# EAGLE schematic BoundaryController (EAGLE 6.6.0)
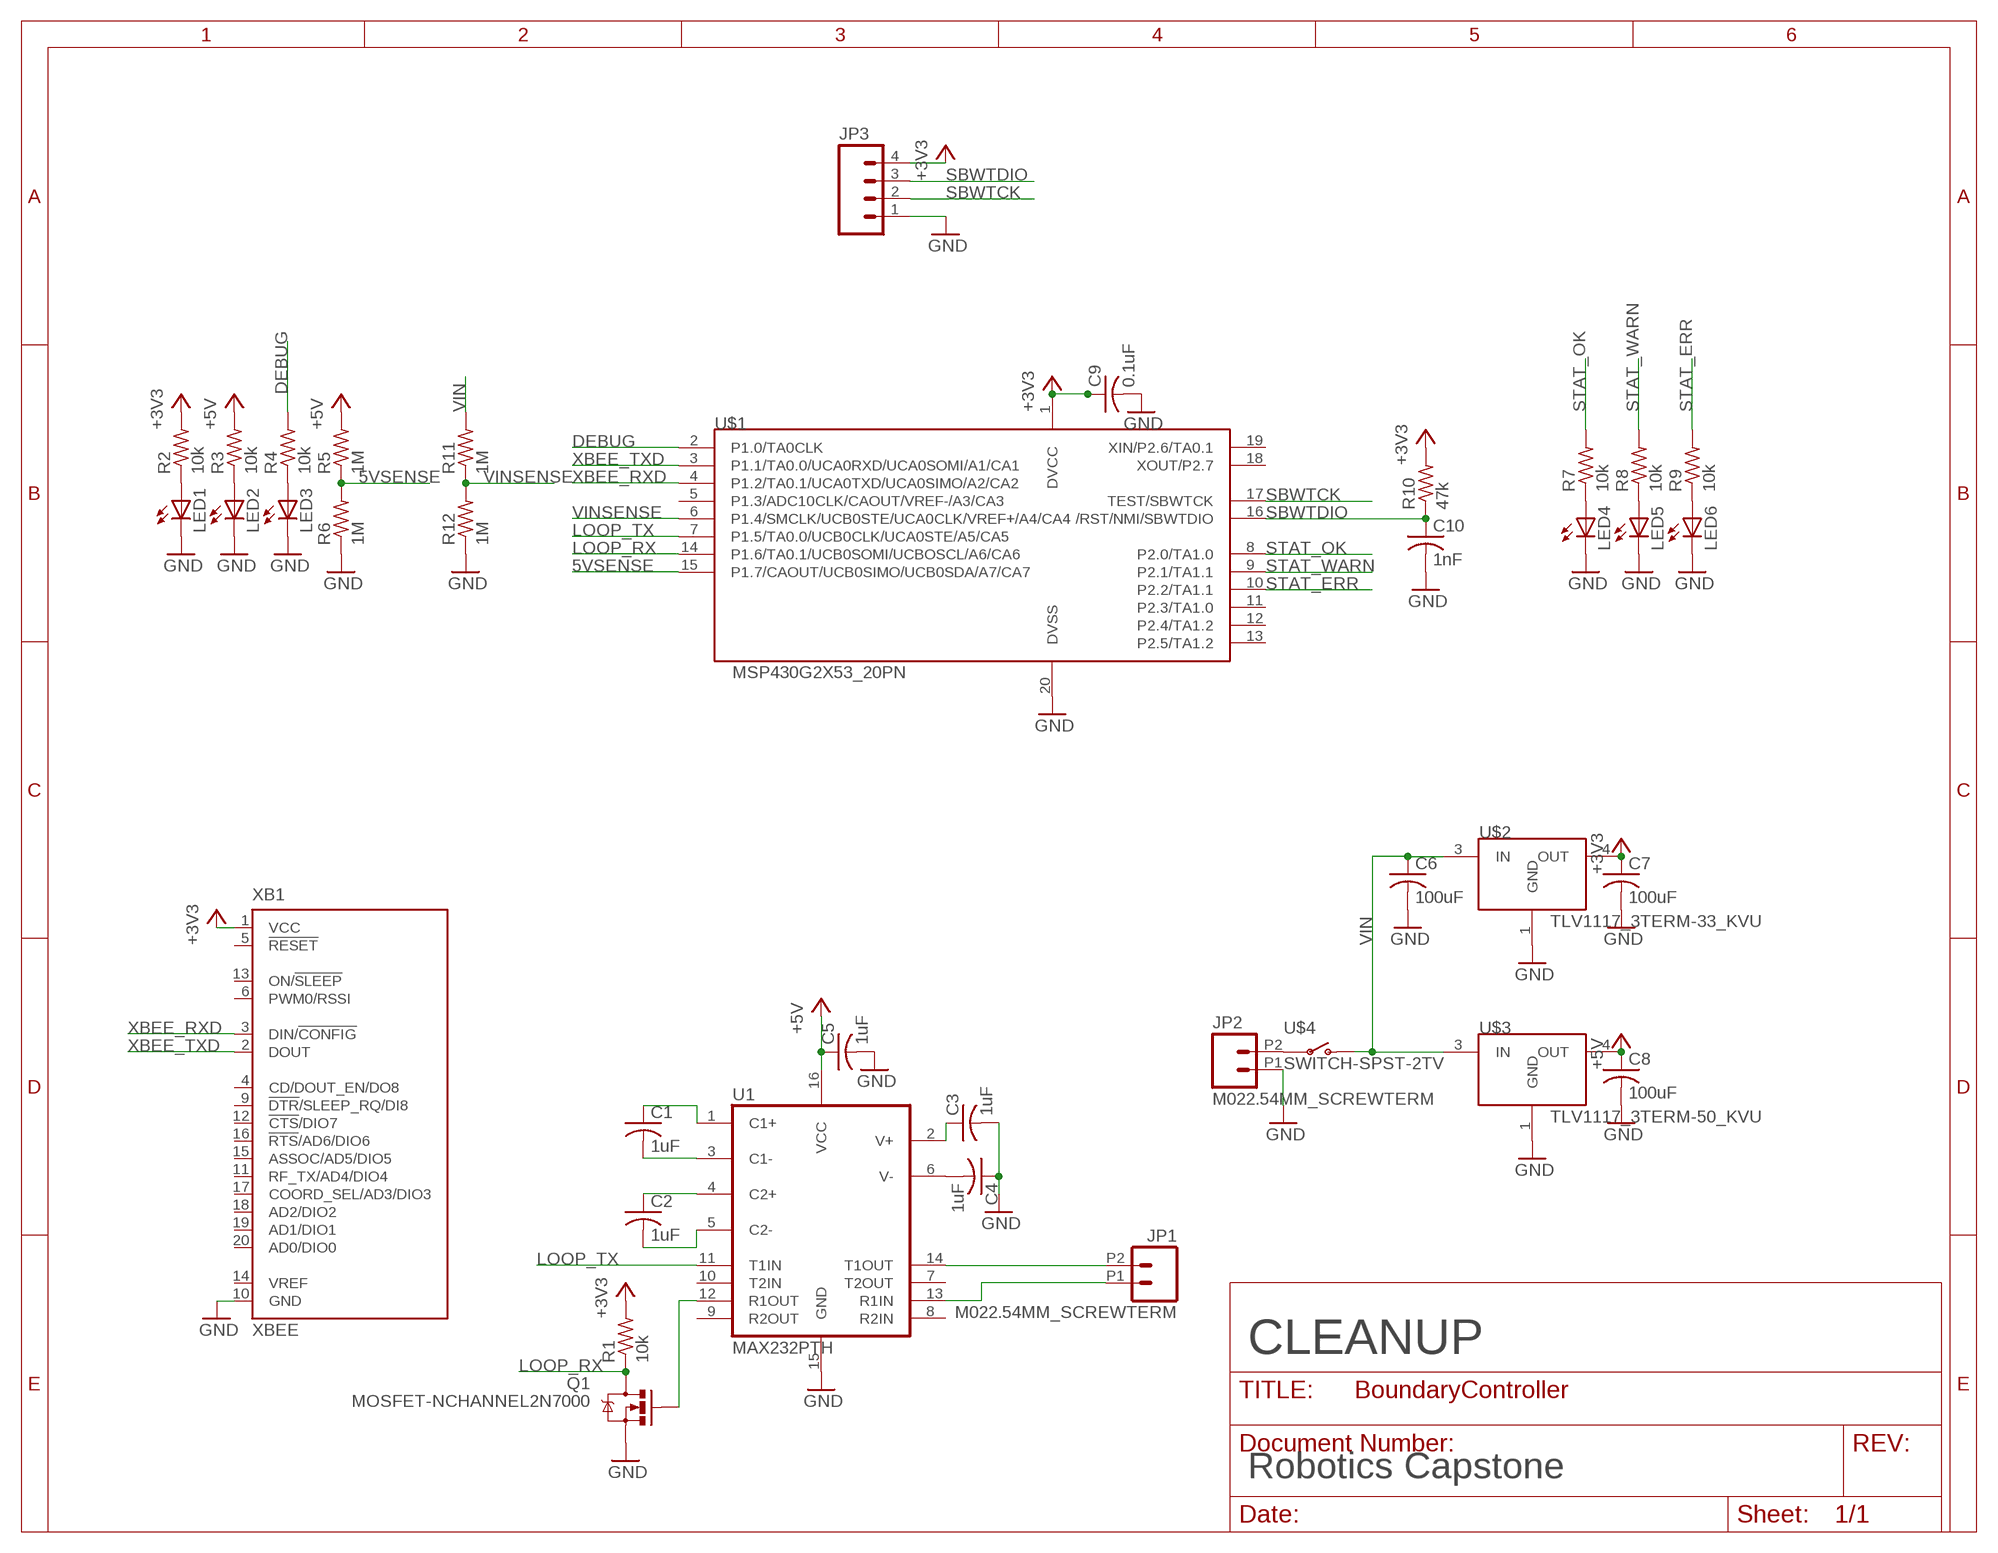
[diagram p0: schematic, sheet 1]

## Parts
C1  1uF  C-USC0603  [C0603]
C2  1uF  C-USC0603  [C0603]
C3  1uF  C-USC0603  [C0603]
C4  1uF  C-USC0603  [C0603]
C5  1uF  C-USC0603  [C0603]
C6  100uF  C-USC0603  [C0603]
C7  100uF  C-USC0603  [C0603]
C8  100uF  C-USC0603  [C0603]
C9  0.1uF  C-USC0603  [C0603]
C10  1nF  C-USC0603  [C0603]
JP1  M022.54MM_SCREWTERM  [1X02_2.54_SCREWTERM]
JP2  M022.54MM_SCREWTERM  [1X02_2.54_SCREWTERM]
JP3  M04PTH  [1X04]
LED1  LED3MM  [LED3MM]
LED2  LED3MM  [LED3MM]
LED3  LED3MM  [LED3MM]
LED4  LED3MM  [LED3MM]
LED5  LED3MM  [LED3MM]
LED6  LED3MM  [LED3MM]
Q1  MOSFET-NCHANNEL2N7000  [TO-92]
R1  10k  R-US_R0603  [R0603]
R2  10k  R-US_R0603  [R0603]
R3  10k  R-US_R0603  [R0603]
R4  10k  R-US_R0603  [R0603]
R5  1M  R-US_R0603  [R0603]
R6  1M  R-US_R0603  [R0603]
R7  10k  R-US_R0603  [R0603]
R8  10k  R-US_R0603  [R0603]
R9  10k  R-US_R0603  [R0603]
R10  47k  R-US_R0603  [R0603]
R11  1M  R-US_R0603  [R0603]
R12  1M  R-US_R0603  [R0603]
U1  MAX232PTH  [DIL16]
U$1  MSP430G2X53_20PN  [DIL20]
U$2  TLV1117_3TERM-33_KVU  [TI_TO-252_KVU_R-PSFM-G3]
U$3  TLV1117_3TERM-50_KVU  [TI_TO-252_KVU_R-PSFM-G3]
U$4  SWITCH-SPST-2TV  [SWITCH-SPST-VERTICAL]
XB1  XBEE  [XBEE]

## Nets
5VSENSE: R5.1 R6.2 U$1.15(P1.7/CAOUT/UCB0SIMO/UCB0SDA/A7/CA7)
+3V3: C7.1 C9.1 JP3.4 R1.2 R2.2 R10.2 U$1.1(DVCC) U$2.4(OUT) XB1.1(VCC)
+5V: C5.1 C8.1 R3.2 R5.2 U1.16(VCC) U$3.4(OUT)
DEBUG: R4.2 U$1.2(P1.0/TA0CLK)
GND: C3.2 C4.1 C5.2 C6.2 C7.2 C8.2 C9.2 C10.2 JP2.P1 JP3.1 LED1.K(C) LED2.K(C) LED3.K(C) LED4.K(C) LED5.K(C) LED6.K(C) Q1.1(S) R6.1 R12.1 U1.15(GND) U$1.20(DVSS) U$2.1(GND) U$3.1(GND) XB1.10(GND)
LOOP_RX: Q1.3(D) R1.1 U$1.14(P1.6/TA0.1/UCB0SOMI/UCBOSCL/A6/CA6)
LOOP_TX: U1.11(T1IN) U$1.7(P1.5/TA0.0/UCB0CLK/UCA0STE/A5/CA5)
N$1: C1.2 U1.3(C1-)
N$2: C1.1 U1.1(C1+)
N$3: C2.1 U1.4(C2+)
N$4: C2.2 U1.5(C2-)
N$5: C4.2 U1.6(V-)
N$6: C3.1 U1.2(V+)
N$8: JP1.P2 U1.14(T1OUT)
N$9: JP1.P1 U1.13(R1IN)
N$10: Q1.2(G) U1.12(R1OUT)
N$11: LED1.A R2.1
N$12: LED2.A R3.1
N$13: JP2.P2 U$4.2(P)
N$14: LED3.A R4.1
N$15: LED4.A R7.1
N$16: LED5.A R8.1
N$17: LED6.A R9.1
SBWTCK: JP3.2 U$1.17(TEST/SBWTCK)
SBWTDIO: C10.1 JP3.3 R10.1 U$1.16(/RST/NMI/SBWTDIO)
STAT_ERR: R9.2 U$1.10(P2.2/TA1.1)
STAT_OK: R7.2 U$1.8(P2.0/TA1.0)
STAT_WARN: R8.2 U$1.9(P2.1/TA1.1)
VIN: C6.1 R11.2 U$2.3(IN) U$3.3(IN) U$4.1(O)
VINSENSE: R11.1 R12.2 U$1.6(P1.4/SMCLK/UCB0STE/UCA0CLK/VREF+/A4/CA4)
XBEE_RXD: U$1.4(P1.2/TA0.1/UCA0TXD/UCA0SIMO/A2/CA2) XB1.3(DIN/!CONFIG)
XBEE_TXD: U$1.3(P1.1/TA0.0/UCA0RXD/UCA0SOMI/A1/CA1) XB1.2(DOUT)
Unconnected: U1.7(T2OUT) U1.8(R2IN) U1.9(R2OUT) U1.10(T2IN) U$1.5(P1.3/ADC10CLK/CAOUT/VREF-/A3/CA3) U$1.11(P2.3/TA1.0) U$1.12(P2.4/TA1.2) U$1.13(P2.5/TA1.2) U$1.18(XOUT/P2.7) U$1.19(XIN/P2.6/TA0.1) XB1.4(CD/DOUT_EN/DO8) XB1.5(!RESET) XB1.6(PWM0/RSSI) XB1.9(!DTR!/SLEEP_RQ/DI8) XB1.11(RF_TX/AD4/DIO4) XB1.12(!CTS!/DIO7) XB1.13(ON/!SLEEP) XB1.14(VREF) XB1.15(ASSOC/AD5/DIO5) XB1.16(!RTS!/AD6/DIO6) XB1.17(COORD_SEL/AD3/DIO3) XB1.18(AD2/DIO2) XB1.19(AD1/DIO1) XB1.20(AD0/DIO0)

## Notes on the sheet
- CLEANUP
- Robotics Capstone

## Library data of the parts
C1-C10 = rcl:C-US: CAPACITOR, American symbol
JP1 JP2 = SparkFun-Connectors:M02: Standard 2-pin 0.1" header. Use with - straight break away headers ( PRT-00116) - right angle break away headers (PRT-00553) - swiss pins (PRT-00743) - machine pins (PRT-00117) - female headers (PRT-00115) Molex polarized connector foot print use with: PRT-08233 with associated crimp pins and housings. 2.54_SCREWTERM for use with PRT-10571. 3.5mm Screw Terminal footprints for PRT-08084 5mm Screw Terminal footprints for use with PRT-08433
JP3 = SparkFun-Connectors:M04: Header 4 Standard 4-pin 0.1" header. Use with straight break away headers (SKU : PRT-00116), right angle break away headers (PRT-00553), swiss pins (PRT-00743), machine pins (PRT-00117), and female headers (PRT-00115). Molex polarized connector foot print use with SKU : PRT-08231 with associated crimp pins and housings. 1MM SMD Version SKU: PRT-10208
LED1-LED6 = SparkFun-LED:LED: LEDs Standard schematic elements and footprints for 5mm, 3mm, 1206, and 0603 sized LEDs. 5mm - Spark Fun Electronics SKU : COM-00529 (and others)
Q1 = SparkFun-DiscreteSemi:MOSFET-NCHANNEL: Common NMOSFET Parts MFG P/N Store ID Prod ID FDD8780 TRANS-09984 SI7820DN TRANS-11055 FDS6630A IC-08089 2N7002PW TRANS-11151 FQP30N06L COM-10213 TRANS-10060 BSS123LT1G TRANS-08345 BSS138 TRANS-00830 BS170 2N7000
R1-R12 = rcl:R-US_: RESISTOR, American symbol
U1 = SparkFun-DigitalIC:MAX232: RS232 Transceiver Very common IC. This is generically called 'MAX232', but works with the 3V equivalent MAX3232 generic ICs. Field tested and mother approved. Spark Fun Electronics SKU : COM-00316 (DIP) and COM-00589 (SMD)
U$1 = npol-msp430:MSP430G2X53_20P: MSP430G2x53 16-bit Microcontroller, 20pin devices
U$2 U$3 = npol-power:TLV1117_3TERM
U$4 = SparkFun-Electromechanical:SWITCH-SPST-2
XB1 = microbuilder:XBEE: XBee (TM) /XBee-PRO(TM) OEM RF Modules Source: MaxStream, Inc. xbee_productmanual.pdf